# Altium schematic sheet 4x tmc5160.SchDoc
size 297 x 209 mm
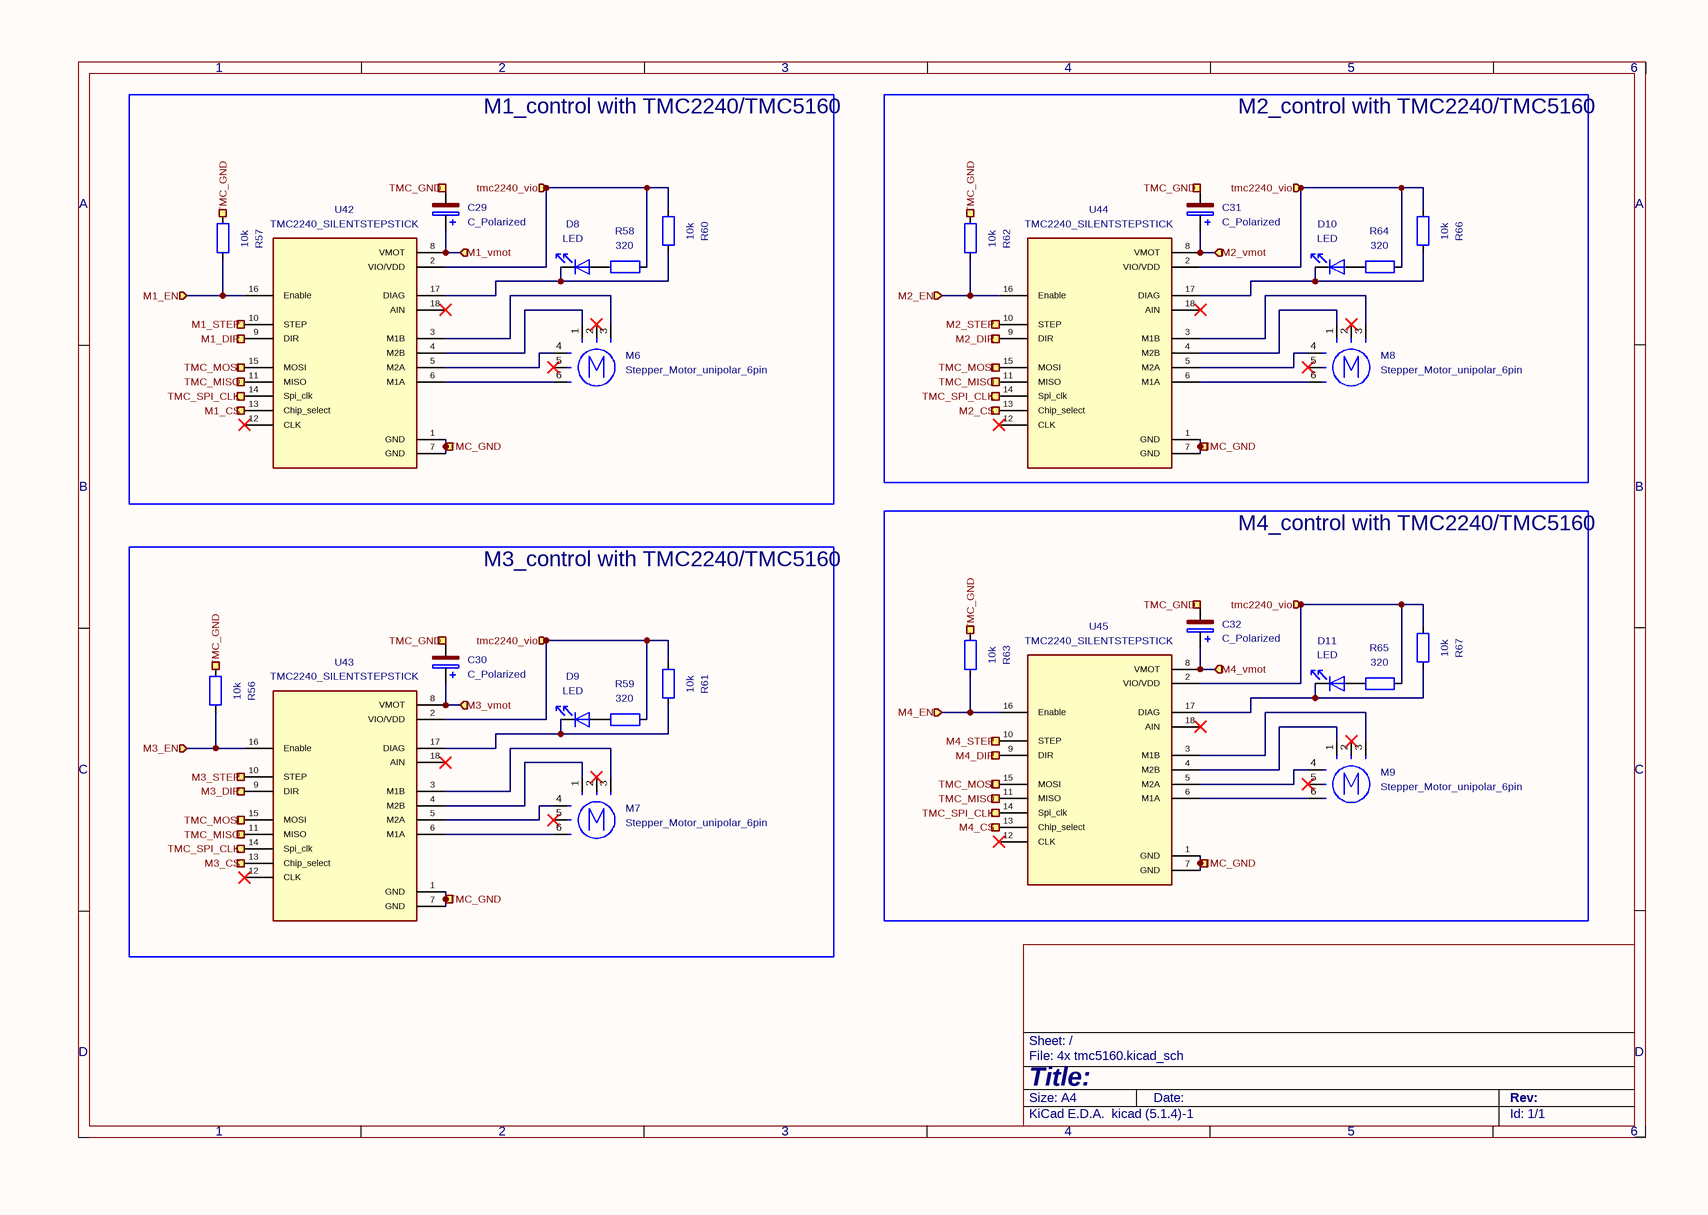
[diagram p0: 4x tmc5160.SchDoc]

## Parts
C29  C_Polarized
C30  C_Polarized
C31  C_Polarized
C32  C_Polarized
D8  LED
D9  LED
D10  LED
D11  LED
M6  Stepper_Motor_unipolar_6pin
M7  Stepper_Motor_unipolar_6pin
M8  Stepper_Motor_unipolar_6pin
M9  Stepper_Motor_unipolar_6pin
R56  10k
R57  10k
R58  320
R59  320
R60  10k
R61  10k
R62  10k
R63  10k
R64  320
R65  320
R66  10k
R67  10k
U42  TMC2240_SILENTSTEPSTICK  [MODULE_TMC2209_SILENTSTEPSTICK]
U43  TMC2240_SILENTSTEPSTICK  [MODULE_TMC2209_SILENTSTEPSTICK]
U44  TMC2240_SILENTSTEPSTICK  [MODULE_TMC2209_SILENTSTEPSTICK]
U45  TMC2240_SILENTSTEPSTICK  [MODULE_TMC2209_SILENTSTEPSTICK]

## Blocks framed on the sheet
M1_control with TMC2240/TMC5160: C29 D8 M6 R57 R58 R60 U42
M2_control with TMC2240/TMC5160: C31 D10 M8 R62 R64 R66 U44
M4_control with TMC2240/TMC5160: C32 D11 M9 R63 R65 R67 U45
M3_control with TMC2240/TMC5160: C30 D9 M7 R56 R59 R61 U43

## Ports
M1_CS (in), M1_DIR (in), M1_EN (in), M1_STEP (in), M1_vmot (in), M2_CS (in), M2_DIR (in), M2_EN (in), M2_STEP (in), M2_vmot (in), M3_CS (in), M3_DIR (in), M3_EN (in), M3_STEP (in), M3_vmot (in), M4_CS (in), M4_DIR (in), M4_EN (in), M4_STEP (in), M4_vmot (in), tmc2240_vio (in), TMC_GND (in), TMC_MISO (in), TMC_MOSI (in), TMC_SPI_CLK (in)

## Nets
M1_CS: U42.13(Chip_select) ; port M1_CS
M1_DIR: U42.9(DIR) ; port M1_DIR
M1_EN: R57.1 U42.16(Enable) ; port M1_EN
M1_STEP: U42.10(STEP) ; port M1_STEP
M1_vmot: C29.1 U42.8(VMOT) ; port M1_vmot
M2_CS: U44.13(Chip_select) ; port M2_CS
M2_DIR: U44.9(DIR) ; port M2_DIR
M2_EN: R62.1 U44.16(Enable) ; port M2_EN
M2_STEP: U44.10(STEP) ; port M2_STEP
M2_vmot: C31.1 U44.8(VMOT) ; port M2_vmot
M3_CS: U43.13(Chip_select) ; port M3_CS
M3_DIR: U43.9(DIR) ; port M3_DIR
M3_EN: R56.1 U43.16(Enable) ; port M3_EN
M3_STEP: U43.10(STEP) ; port M3_STEP
M3_vmot: C30.1 U43.8(VMOT) ; port M3_vmot
M4_CS: U45.13(Chip_select) ; port M4_CS
M4_DIR: U45.9(DIR) ; port M4_DIR
M4_EN: R63.1 U45.16(Enable) ; port M4_EN
M4_STEP: U45.10(STEP) ; port M4_STEP
M4_vmot: C32.1 U45.8(VMOT) ; port M4_vmot
tmc2240_vio: R58.2 R59.2 R60.2 R61.2 R64.2 R65.2 R66.2 R67.2 U42.2(VIO/VDD) U43.2(VIO/VDD) U44.2(VIO/VDD) U45.2(VIO/VDD) ; port tmc2240_vio
TMC_GND: C29.2 C30.2 C31.2 C32.2 R56.2 R57.2 R62.2 R63.2 U42.1(GND) U42.7(GND) U43.1(GND) U43.7(GND) U44.1(GND) U44.7(GND) U45.1(GND) U45.7(GND) ; port TMC_GND
TMC_MISO: U42.11(MISO) U43.11(MISO) U44.11(MISO) U45.11(MISO) ; port TMC_MISO
TMC_MOSI: U42.15(MOSI) U43.15(MOSI) U44.15(MOSI) U45.15(MOSI) ; port TMC_MOSI
TMC_SPI_CLK: U42.14(Spi_clk) U43.14(Spi_clk) U44.14(Spi_clk) U45.14(Spi_clk) ; port TMC_SPI_CLK
NetD8_1: D8.1(K) R60.1 U42.17(DIAG)
NetD8_2: D8.2(A) R58.1
NetD9_1: D9.1(K) R61.1 U43.17(DIAG)
NetD9_2: D9.2(A) R59.1
NetD10_1: D10.1(K) R66.1 U44.17(DIAG)
NetD10_2: D10.2(A) R64.1
NetD11_1: D11.1(K) R67.1 U45.17(DIAG)
NetD11_2: D11.2(A) R65.1
NetM6_1: M6.1 U42.4(M2B)
NetM6_3: M6.3(-) U42.3(M1B)
NetM6_4: M6.4 U42.5(M2A)
NetM6_6: M6.6 U42.6(M1A)
NetM7_1: M7.1 U43.4(M2B)
NetM7_3: M7.3(-) U43.3(M1B)
NetM7_4: M7.4 U43.5(M2A)
NetM7_6: M7.6 U43.6(M1A)
NetM8_1: M8.1 U44.4(M2B)
NetM8_3: M8.3(-) U44.3(M1B)
NetM8_4: M8.4 U44.5(M2A)
NetM8_6: M8.6 U44.6(M1A)
NetM9_1: M9.1 U45.4(M2B)
NetM9_3: M9.3(-) U45.3(M1B)
NetM9_4: M9.4 U45.5(M2A)
NetM9_6: M9.6 U45.6(M1A)

Not connected (* = marked no-connect by the designer): M6 2* 5*; M7 2* 5*; M8 2* 5*; M9 2* 5*; U42 12(CLK)* 18(AIN)*; U43 12(CLK)* 18(AIN)*; U44 12(CLK)* 18(AIN)*; U45 12(CLK)* 18(AIN)*

## Notes on the sheet
- 1
- 2
- 3
- 4
- 5
- 6
- A
- B
- C
- D
- Title:
- File: 4x tmc5160.kicad_sch
- Sheet: /
- KiCad E.D.A.  kicad (5.1.4)-1
- Size: A4
- Date:
- Rev:
- Id: 1/1

## Library data of the parts
R56-R67 = R
  R56 R57 R60-R63 R66 R67: Value: 10k
  R58 R59 R64 R65: Value: 320
U42-U45 = TMC2209_SILENTSTEPSTICK: MF: Trinamic Motion Control GmbH; Description_1: \n                        \n                            TMC2209 Motor Controller/Driver Power Management Evaluation Board\n                        \n; MP: TMC2209 SILENTSTEPSTICK; Package: None; Price: None; Check_prices: https://www.snapeda.com/parts/TMC2209%20SILENTSTEPSTICK/Trinamic/view-part/?ref=eda; STANDARD: Manufacturer Recommendations; PARTREV: 1.20; SnapEDA_Link: https://www.snapeda.com/parts/TMC2209%20SILENTSTEPSTICK/Trinamic/view-part/?ref=snap; MANUFACTURER: Trinamic Motion Control GmbH; Availability: In Stock; SNAPEDA_PN: TMC2209 SILENTSTEPSTICK; Value: TMC2240_SILENTSTEPSTICK; Footprint: fds:MODULE_TMC2209_SILENTSTEPSTICK
C29-C32 = C_Polarized: Value: C_Polarized
D8-D11 = LED: Value: LED
M6-M9 = Stepper_Motor_unipolar_6pin: Value: Stepper_Motor_unipolar_6pin